# Altium schematic sheet Magellan+ISO+-+Board+B.schdoc
size 322 x 196 mm
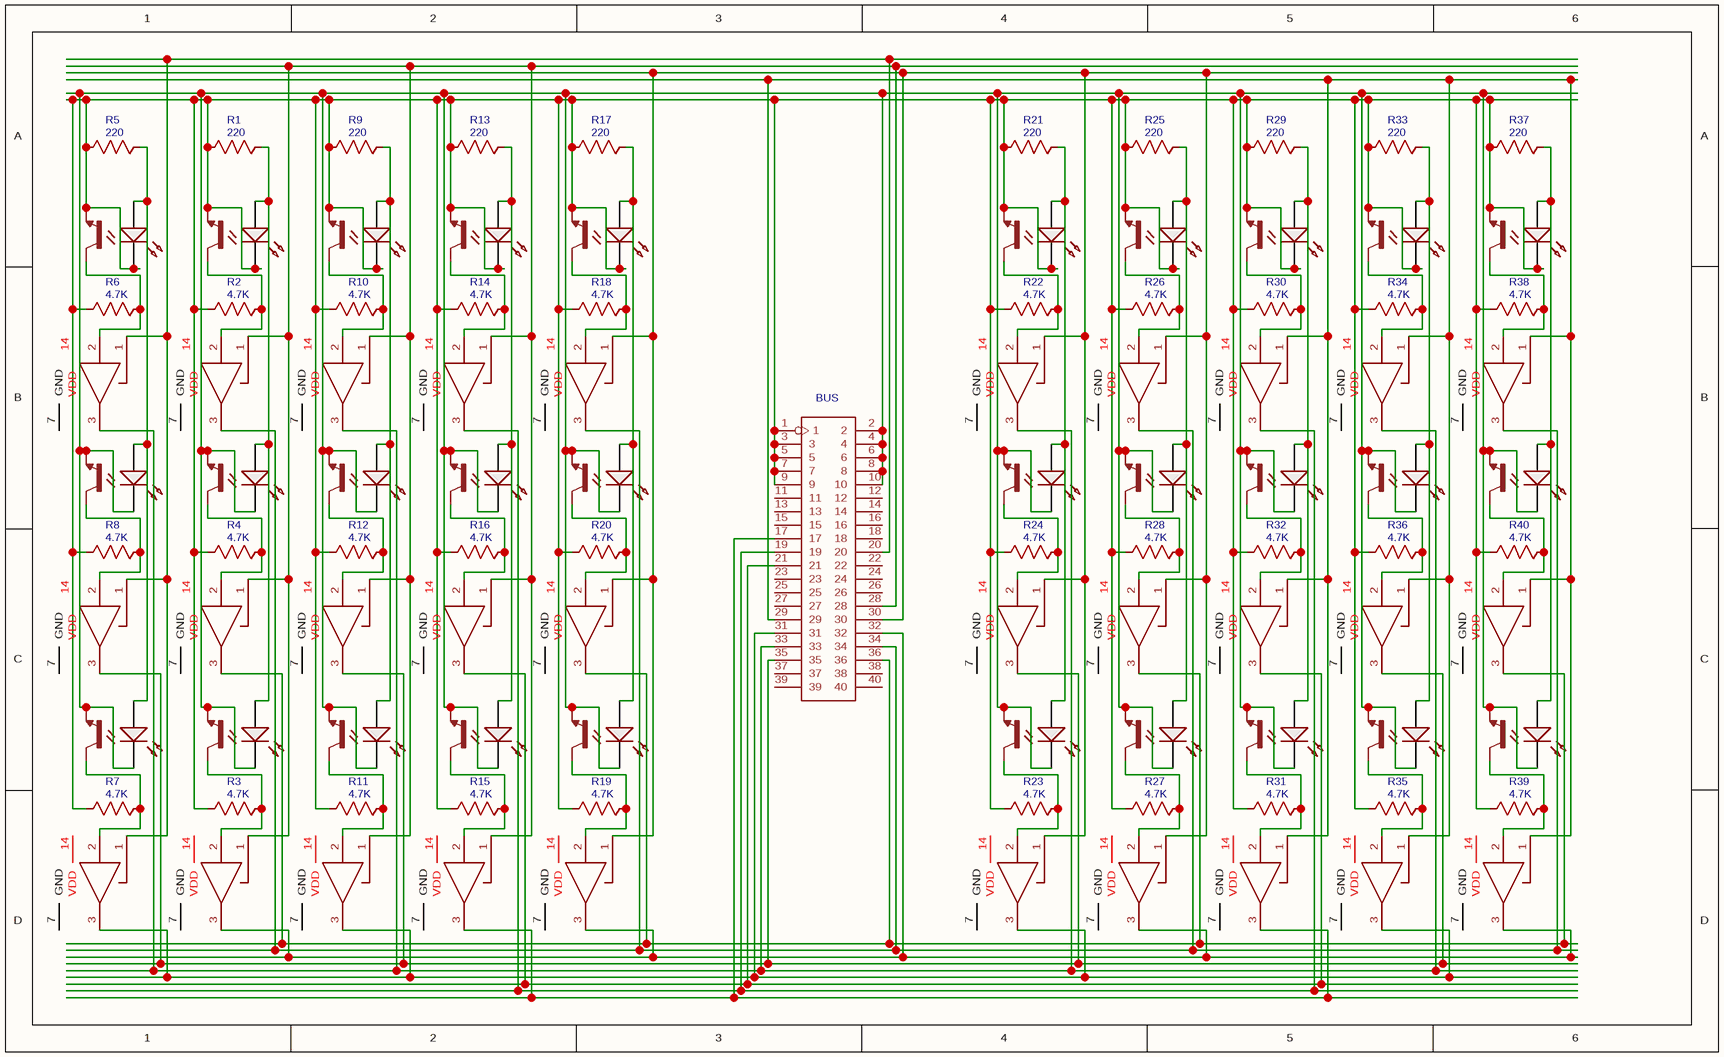
[diagram p0: Magellan+ISO+-+Board+B.schdoc]

## Parts
BUS  (no value)  [40 Pin Header (Rasp Pi Layout)]
LED1  (no value)  [LED-3MM/2.54]
LED2  (no value)  [LED-3MM/2.54]
LED3  (no value)  [LED-3MM/2.54]
LED4  (no value)  [LED-3MM/2.54]
LED5  (no value)  [LED-3MM/2.54]
LED6  (no value)  [LED-3MM/2.54]
LED7  (no value)  [LED-3MM/2.54]
LED8  (no value)  [LED-3MM/2.54]
LED9  (no value)  [LED-3MM/2.54]
LED10  (no value)  [LED-3MM/2.54]
LED11  (no value)  [LED-3MM/2.54]
LED12  (no value)  [LED-3MM/2.54]
LED13  (no value)  [LED-3MM/2.54]
LED14  (no value)  [LED-3MM/2.54]
LED15  (no value)  [LED-3MM/2.54]
LED16  (no value)  [LED-3MM/2.54]
LED17  (no value)  [LED-3MM/2.54]
LED18  (no value)  [LED-3MM/2.54]
LED19  (no value)  [LED-3MM/2.54]
LED20  (no value)  [LED-3MM/2.54]
LED21  (no value)  [LED-3MM/2.54]
LED22  (no value)  [LED-3MM/2.54]
LED23  (no value)  [LED-3MM/2.54]
LED24  (no value)  [LED-3MM/2.54]
LED25  (no value)  [LED-3MM/2.54]
LED26  (no value)  [LED-3MM/2.54]
LED27  (no value)  [LED-3MM/2.54]
LED28  (no value)  [LED-3MM/2.54]
LED29  (no value)  [LED-3MM/2.54]
LED30  (no value)  [LED-3MM/2.54]
Q1  (no value)  [PT17-21C-L41-TR8]
Q2  (no value)  [PT17-21C-L41-TR8]
Q3  (no value)  [PT17-21C-L41-TR8]
Q4  (no value)  [PT17-21C-L41-TR8]
Q5  (no value)  [PT17-21C-L41-TR8]
Q6  (no value)  [PT17-21C-L41-TR8]
Q7  (no value)  [PT17-21C-L41-TR8]
Q8  (no value)  [PT17-21C-L41-TR8]
Q9  (no value)  [PT17-21C-L41-TR8]
Q10  (no value)  [PT17-21C-L41-TR8]
Q11  (no value)  [PT17-21C-L41-TR8]
Q12  (no value)  [PT17-21C-L41-TR8]
Q13  (no value)  [PT17-21C-L41-TR8]
Q14  (no value)  [PT17-21C-L41-TR8]
Q15  (no value)  [PT17-21C-L41-TR8]
Q16  (no value)  [PT17-21C-L41-TR8]
Q17  (no value)  [PT17-21C-L41-TR8]
Q18  (no value)  [PT17-21C-L41-TR8]
Q19  (no value)  [PT17-21C-L41-TR8]
Q20  (no value)  [PT17-21C-L41-TR8]
Q21  (no value)  [PT17-21C-L41-TR8]
Q22  (no value)  [PT17-21C-L41-TR8]
Q23  (no value)  [PT17-21C-L41-TR8]
Q24  (no value)  [PT17-21C-L41-TR8]
Q25  (no value)  [PT17-21C-L41-TR8]
Q26  (no value)  [PT17-21C-L41-TR8]
Q27  (no value)  [PT17-21C-L41-TR8]
Q28  (no value)  [PT17-21C-L41-TR8]
Q29  (no value)  [PT17-21C-L41-TR8]
Q30  (no value)  [PT17-21C-L41-TR8]
R1  value 220  [AXIAL-0.3]
R2  value 4.7K  [AXIAL-0.3]
R3  value 4.7K  [AXIAL-0.3]
R4  value 4.7K  [AXIAL-0.3]
R5  value 220  [AXIAL-0.3]
R6  value 4.7K  [AXIAL-0.3]
R7  value 4.7K  [AXIAL-0.3]
R8  value 4.7K  [AXIAL-0.3]
R9  value 220  [AXIAL-0.3]
R10  value 4.7K  [AXIAL-0.3]
R11  value 4.7K  [AXIAL-0.3]
R12  value 4.7K  [AXIAL-0.3]
R13  value 220  [AXIAL-0.3]
R14  value 4.7K  [AXIAL-0.3]
R15  value 4.7K  [AXIAL-0.3]
R16  value 4.7K  [AXIAL-0.3]
R17  value 220  [AXIAL-0.3]
R18  value 4.7K  [AXIAL-0.3]
R19  value 4.7K  [AXIAL-0.3]
R20  value 4.7K  [AXIAL-0.3]
R21  value 220  [AXIAL-0.3]
R22  value 4.7K  [AXIAL-0.3]
R23  value 4.7K  [AXIAL-0.3]
R24  value 4.7K  [AXIAL-0.3]
R25  value 220  [AXIAL-0.3]
R26  value 4.7K  [AXIAL-0.3]
R27  value 4.7K  [AXIAL-0.3]
R28  value 4.7K  [AXIAL-0.3]
R29  value 220  [AXIAL-0.3]
R30  value 4.7K  [AXIAL-0.3]
R31  value 4.7K  [AXIAL-0.3]
R32  value 4.7K  [AXIAL-0.3]
R33  value 220  [AXIAL-0.3]
R34  value 4.7K  [AXIAL-0.3]
R35  value 4.7K  [AXIAL-0.3]
R36  value 4.7K  [AXIAL-0.3]
R37  value 220  [AXIAL-0.3]
R38  value 4.7K  [AXIAL-0.3]
R39  value 4.7K  [AXIAL-0.3]
R40  value 4.7K  [AXIAL-0.3]
U1.1  (no value)  [DIP14]
U2.1  (no value)  [DIP14]
U3.1  (no value)  [DIP14]
U4.1  (no value)  [DIP14]
U5.1  (no value)  [DIP14]
U6.1  (no value)  [DIP14]
U7.1  (no value)  [DIP14]
U8.1  (no value)  [DIP14]
U9.1  (no value)  [DIP14]
U10.1  (no value)  [DIP14]
U11.1  (no value)  [DIP14]
U12.1  (no value)  [DIP14]
U13.1  (no value)  [DIP14]
U14.1  (no value)  [DIP14]
U15.1  (no value)  [DIP14]
U16.1  (no value)  [DIP14]
U17.1  (no value)  [DIP14]
U18.1  (no value)  [DIP14]
U19.1  (no value)  [DIP14]
U20.1  (no value)  [DIP14]
U21.1  (no value)  [DIP14]
U22.1  (no value)  [DIP14]
U23.1  (no value)  [DIP14]
U24.1  (no value)  [DIP14]
U25.1  (no value)  [DIP14]
U26.1  (no value)  [DIP14]
U27.1  (no value)  [DIP14]
U28.1  (no value)  [DIP14]
U29.1  (no value)  [DIP14]
U30.1  (no value)  [DIP14]

## Nets
NetBUS_1: BUS.1 BUS.3 BUS.5 BUS.7 BUS.9 LED1.2(C) LED3.2(C) LED7.2(C) LED10.2(C) LED13.2(C) LED16.2(C) LED19.2(C) LED22.2(C) LED25.2(C) LED28.2(C) Q1.E Q3.E Q7.E Q10.E Q13.E Q16.E Q19.E Q22.E Q25.E Q28.E R1.2 R2.1 R3.1 R4.1 R5.2 R6.1 R7.1 R8.1 R9.2 R10.1 R11.1 R12.1 R13.2 R14.1 R15.1 R16.1 R17.2 R18.1 R19.1 R20.1 R21.2 R22.1 R23.1 R24.1 R25.2 R26.1 R27.1 R28.1 R29.2 R30.1 R31.1 R32.1 R33.2 R34.1 R35.1 R36.1 R37.2 R38.1 R39.1 R40.1 U1.1.14(VDD) U2.1.14(VDD) U4.1.14(VDD) U6.1.14(VDD) U7.1.14(VDD) U9.1.14(VDD) U10.1.14(VDD) U12.1.14(VDD) U13.1.14(VDD) U15.1.14(VDD) U16.1.14(VDD) U18.1.14(VDD) U19.1.14(VDD) U21.1.14(VDD) U22.1.14(VDD) U24.1.14(VDD) U25.1.14(VDD) U27.1.14(VDD) U28.1.14(VDD) U30.1.14(VDD)
NetBUS_2: BUS.2 BUS.4 BUS.6 BUS.8 BUS.10 LED2.2(C) LED4.2(C) LED5.2(C) LED6.2(C) LED8.2(C) LED9.2(C) LED11.2(C) LED12.2(C) LED14.2(C) LED15.2(C) LED17.2(C) LED18.2(C) LED20.2(C) LED21.2(C) LED23.2(C) LED24.2(C) LED26.2(C) LED27.2(C) LED29.2(C) LED30.2(C) Q2.E Q4.E Q5.E Q6.E Q8.E Q9.E Q11.E Q12.E Q14.E Q15.E Q17.E Q18.E Q20.E Q21.E Q23.E Q24.E Q26.E Q27.E Q29.E Q30.E
NetBUS_17: BUS.17 U11.1.3(Y) U23.1.3(Y)
NetBUS_19: BUS.19 U10.1.3(Y) U22.1.3(Y)
NetBUS_20: BUS.20 U1.1.1(A) U5.1.1(A) U6.1.1(A)
NetBUS_21: BUS.21 U12.1.3(Y) U24.1.3(Y)
NetBUS_28: BUS.28 U2.1.1(A) U3.1.1(A) U4.1.1(A) U7.1.1(A) U8.1.1(A) U9.1.1(A) U10.1.1(A) U11.1.1(A) U12.1.1(A)
NetBUS_29: BUS.29 U22.1.1(A) U23.1.1(A) U24.1.1(A) U25.1.1(A) U26.1.1(A) U27.1.1(A) U28.1.1(A) U29.1.1(A) U30.1.1(A)
NetBUS_30: BUS.30 U13.1.1(A) U14.1.1(A) U15.1.1(A) U16.1.1(A) U17.1.1(A) U18.1.1(A) U19.1.1(A) U20.1.1(A) U21.1.1(A)
NetBUS_31: BUS.31 U5.1.3(Y) U8.1.3(Y) U17.1.3(Y) U26.1.3(Y)
NetBUS_32: BUS.32 U3.1.3(Y) U14.1.3(Y) U20.1.3(Y) U29.1.3(Y)
NetBUS_33: BUS.33 U1.1.3(Y) U7.1.3(Y) U16.1.3(Y) U25.1.3(Y)
NetBUS_34: BUS.34 U2.1.3(Y) U13.1.3(Y) U19.1.3(Y) U28.1.3(Y)
NetBUS_35: BUS.35 U6.1.3(Y) U9.1.3(Y) U18.1.3(Y) U27.1.3(Y)
NetBUS_36: BUS.36 U4.1.3(Y) U15.1.3(Y) U21.1.3(Y) U30.1.3(Y)
NetLED1_1: LED1.1(A) LED2.1(A) LED4.1(A) R1.1
NetLED3_1: LED3.1(A) LED5.1(A) LED6.1(A) R5.1
NetLED7_1: LED7.1(A) LED8.1(A) LED9.1(A) R9.1
NetLED10_1: LED10.1(A) LED11.1(A) LED12.1(A) R13.1
NetLED13_1: LED13.1(A) LED14.1(A) LED15.1(A) R17.1
NetLED16_1: LED16.1(A) LED17.1(A) LED18.1(A) R21.1
NetLED19_1: LED19.1(A) LED20.1(A) LED21.1(A) R25.1
NetLED22_1: LED22.1(A) LED23.1(A) LED24.1(A) R29.1
NetLED25_1: LED25.1(A) LED26.1(A) LED27.1(A) R33.1
NetLED28_1: LED28.1(A) LED29.1(A) LED30.1(A) R37.1
NetQ1_C: Q1.C R2.2 U2.1.2(B)
NetQ2_C: Q2.C R3.2 U3.1.2(B)
NetQ3_C: Q3.C R6.2 U1.1.2(B)
NetQ4_C: Q4.C R4.2 U4.1.2(B)
NetQ5_C: Q5.C R7.2 U5.1.2(B)
NetQ6_C: Q6.C R8.2 U6.1.2(B)
NetQ7_C: Q7.C R10.2 U7.1.2(B)
NetQ8_C: Q8.C R11.2 U8.1.2(B)
NetQ9_C: Q9.C R12.2 U9.1.2(B)
NetQ10_C: Q10.C R14.2 U10.1.2(B)
NetQ11_C: Q11.C R15.2 U11.1.2(B)
NetQ12_C: Q12.C R16.2 U12.1.2(B)
NetQ13_C: Q13.C R18.2 U13.1.2(B)
NetQ14_C: Q14.C R19.2 U14.1.2(B)
NetQ15_C: Q15.C R20.2 U15.1.2(B)
NetQ16_C: Q16.C R22.2 U16.1.2(B)
NetQ17_C: Q17.C R23.2 U17.1.2(B)
NetQ18_C: Q18.C R24.2 U18.1.2(B)
NetQ19_C: Q19.C R26.2 U19.1.2(B)
NetQ20_C: Q20.C R27.2 U20.1.2(B)
NetQ21_C: Q21.C R28.2 U21.1.2(B)
NetQ22_C: Q22.C R30.2 U22.1.2(B)
NetQ23_C: Q23.C R31.2 U23.1.2(B)
NetQ24_C: Q24.C R32.2 U24.1.2(B)
NetQ25_C: Q25.C R34.2 U25.1.2(B)
NetQ26_C: Q26.C R35.2 U26.1.2(B)
NetQ27_C: Q27.C R36.2 U27.1.2(B)
NetQ28_C: Q28.C R38.2 U28.1.2(B)
NetQ29_C: Q29.C R39.2 U29.1.2(B)
NetQ30_C: Q30.C R40.2 U30.1.2(B)

Not connected (* = marked no-connect by the designer): BUS 11 12 13 14 15 16 18 22 23 24 25 26 27 37 38 39 40; U1.1 7(GND); U2.1 7(GND); U3.1 7(GND) 14(VDD); U4.1 7(GND); U5.1 7(GND) 14(VDD); U6.1 7(GND); U7.1 7(GND); U8.1 7(GND) 14(VDD); U9.1 7(GND); U10.1 7(GND); U11.1 7(GND) 14(VDD); U12.1 7(GND); U13.1 7(GND); U14.1 7(GND) 14(VDD); U15.1 7(GND); U16.1 7(GND); U17.1 7(GND) 14(VDD); U18.1 7(GND); U19.1 7(GND); U20.1 7(GND) 14(VDD); U21.1 7(GND); U22.1 7(GND); U23.1 7(GND) 14(VDD); U24.1 7(GND); U25.1 7(GND); U26.1 7(GND) 14(VDD); U27.1 7(GND); U28.1 7(GND); U29.1 7(GND) 14(VDD); U30.1 7(GND)

## Library data of the parts
BUS = (no symbol name): BOM_Manufacturer Part: F185-1226A0BSYB1; catid: 20; description: DIP Black Header Female VERT;; BOM_SeeedStudio: 320030034; sourceId: GMGARL3Xf; Value: DIP-BLACK-HEADER-FEMALE-VERT-RASPPI(2X13P-2.54); BOM_Supplier: Unknown; timeStamp: 1453425879; spicePre: J
LED1-LED30 = (no symbol name): BOM_Manufacturer: EVERLIGHT; BOM_Manufacturer Part: 204-10UYC/S530-A3; Value: 204-10UYC/S530-A3; BOM_LCSC: C73643; BOM_Supplier: LCSC; spicePre: L
Q1-Q30 = (no symbol name): catid: 20; Contributor: SparkFun; Value: PHOTOTRANSISTORPT17-21C-L41-TR8; BOM_Manufacturer Part: ?; spicePre: Q
R1-R40 = (no symbol name): nameAlias: Value(Ω); BOM_Manufacturer Part: ?; spicePre: R; spiceSymbolName: Resistor
U1.1 U2.1 U3.1 U4.1 U5.1 U6.1 U7.1 U8.1 U9.1 U10.1 U11.1 U12.1 U13.1 U14.1 U15.1 U16.1 U17.1 U18.1 U19.1 U20.1 U21.1 U22.1 U23.1 U24.1 U25.1 U26.1 U27.1 U28.1 U29.1 U30.1 = (no symbol name): catid: 20; description: Quad 3-State Buffer; Value: SN74LS125AN; BOM_Manufacturer Part: ?; spicePre: U